# Altium schematic sheet downConverter.SchDoc
size A4
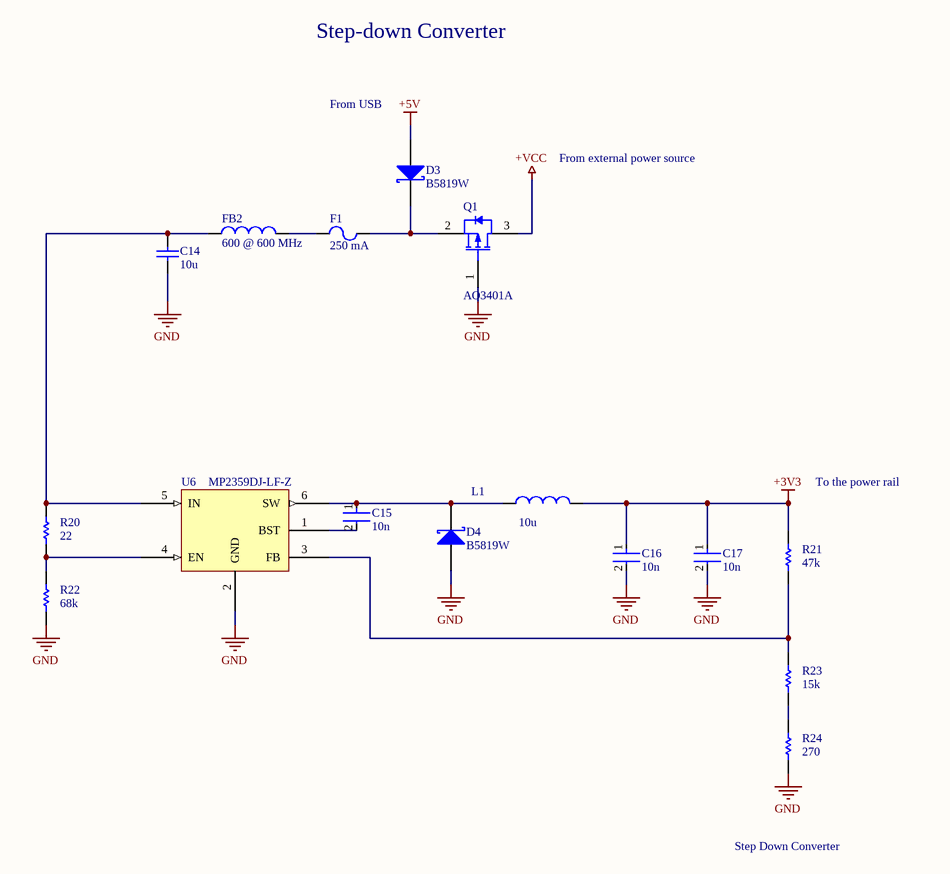
[diagram p0: downConverter.SchDoc]

## Parts
C14  10u  [Capacitor 1206]
C15  10n  [Capacitor 0402]
C16  10n  [Capacitor 0402]
C17  10n  [Capacitor 0402]
D3  B5819W  [SOD3716X135N]
D4  B5819W  [SOD3716X135N]
F1  250 mA  [Fuse 1206]
FB2  600 @ 600 MHz  [Inductor 0805]
L1  10u  [LQH32DN100K23L]
Q1  AO3401A  [SOT95P245X110-3N]
R20  22  [RESISTOR 0603]
R21  47k  [RESISTOR 0603]
R22  68k  [RESISTOR 0603]
R23  15k  [RESISTOR 0603]
R24  270  [RESISTOR 0603]
U6  MP2359DJ-LF-Z  [SOT95P280X100-6N]

## Nets
+3V3: C16.1 C17.1 L1.2 R21.2
+5V: D3.1(A)
+VCC: Q1.3(DRAIN)
GND: C14.1 C16.2 C17.2 D4.1(A) Q1.1(GATE) R22.1 R24.1 U6.2(GND)
NetC14_2: C14.2 FB2.1 R20.2 U6.5(IN)
NetC15_1: C15.1 D4.2(K) L1.1 U6.6(SW)
NetC15_2: C15.2 U6.1(BST)
NetD3_2: D3.2(K) F1.2 Q1.2(SOURCE)
NetF1_1: F1.1 FB2.2
NetR20_1: R20.1 R22.2 U6.4(EN)
NetR21_1: R21.1 R23.2 U6.3(FB)
NetR23_1: R23.1 R24.2

## Notes on the sheet
- Step-down Converter
- From USB
- From external power source
- To the power rail
- Step Down Converter

## Library data of the parts
C14 = Capacitor 1206: Chip Capacitor, 1206; Manufacturer: Murata; Manufacturer Part Number: GRM1885C1H220JA01D; Capacitance: 22pF; Tolerance (%): ±5%; Rated Voltage: 50V; Dielectric: C0G; Manufacturer URL: http://www.murata.com/; Datasheet Version: Jul-06; Package Reference: 603; Case Size/Dimension: 0603; Package Description: 2-Pin Surface Mount Device, Body 1.6 x 0.8 mm; Datasheet URL: https://datasheet.ciiva.com/11786/0900766b807a1cab-11786398.pdf
C15-C17 = Capacitor 0402: Chip Capacitor 0402; Manufacturer Part Number: CC0402KRX7R7BB103; Manufacturer: Yageo; Automotive Grade: NA; Capacitance: 10 nF; Material: Ceramic; Value: 10 nF; Tolerance: 0.1; Temperature Characteristic: X7R; Voltage Rating: 16 V; Temperature Coefficient: 30ppm/°C; Temperature Range Low: -55°C; Temperature Range High: +125°C; Mouser Description: 0402 10 nF 16 V ±10 % Tolerance X7R SMT Multilayer Ceramic Capacitor; Footprint Url: http://www.yageo.com/exep/pages/download/literatures/UPY-C_GEN_24.pdf; Category: Cap; RoHS: TRUE; ComponentLink2Description: Datasheet; Ipc Land Pattern Name: CAPC10050X50; Automotive: No; ComponentLink2URL: http://www.yageo.com/documents/recent/UPY-GP_NP0_16V-to-50V_16.pdf; Device Class L1: Passive Components; Height: 0.55mm; Package: CC0402; Device Class L3: Ceramic Capacitors; Lead Free: Yes; Device Class L2: Capacitors; Digikey Description: CAP CER 10000PF 16V X7R 0402; Octopart: https://octopart.com/cc0402krx7r7bb103-yageo-192895; Temperature: -55°C to +125°C
D3 D4 = Schottky Barrier Rectifier: Schottky Barrier Rectifier, 20 V, 1 A, -65 to 150 degC, 2-Pin DO-214AC (SMA), RoHS, Tape and Reel; Manufacturer: Vishay Intertechnology; Manufacturer Part Number: SS12-E3\61T; Max Surge Current: 40A; Forward Voltage: 500mV; Forward Current: 1A; Peak Reverse Current: 6mA; Package Quantity: 1800; Datasheet URL: http://www.vishay.com/docs/88746/ss12.pdf; Case/Package: SMA; Package Description: 2-Pin Surface Mount Device, Body 4.245 x 2.665 mm; Pins: 2; Mounting Technology: SM; Min Operating Temperature: -65°C; Packaging: TapeandReel; Datasheet Version: Aug-15; Manufacturer URL: http://www.vishay.com/; RoHS Compliant: True; Package Reference: DO-214AC (SMA); Max Operating Temperature: 125°C; Component Type: Diodes
F1 = Fuse 1206: NANO2(R) Slo-Blo(R) Fuse, 0.5 A, 125 V, -55 to 125 degC, 2-Pin SMD, RoHS, Tape and Reel; Manufacturer: Littelfuse; Manufacturer Part Number: 0452.500MRL; Current Rating: 0.5A; Working Voltage-Max: 125V; Manufacturer URL: http://www.littelfuse.com/; Operating Temp Range: -55to+125°C; Package Reference: 0452; Mounting Technology: SurfaceMount; Datasheet Version: 07/2015; Response Characteristic: Slo-Blo; Datasheet URL: http://download.siliconexpert.com/pdfs/2015/7/2/10/39/10/885/ltf_/manual/4322647674859060843226474844920160littelfuse_fuse_452_454_datasheet.pdf.pdf.pdf; Size: 6.10x2.69mm; Package Description: 2-Pin Surface Mount Device, Body 6.1 x 2.69 mm
FB2 = Ferrite Bead: Ferrite Bead Murata BLM21AG601SN1D; Manufacturer: TDK; Manufacturer Part Number: MLZ2012A1R0MT000; Tolerance (%): 20%; DC Resistance: 0.6; Inductance-Nom: 10H; Rated Current-Max: 100mA; Package Reference: IND0805; Case Size/Dimension: 0805; Manufacturer URL: http://www.murata.com/; Package Description: 2-Pin Surface Mount Device, Body 2 x 1.25 mm; Datasheet URL: http://psearch.en.murata.com/inductor/product/LQM21FN100M70%23.pdf; Mounting Technology: SurfaceMount; Datasheet Version: 05/2016
L1 = Fixed Inductor: LQH32CN100K33L 10uh; Manufacturer: TDK; Manufacturer Part Number: MLZ2012A1R0MT000; Tolerance (%): 20%; DC Resistance: 0.6; Inductance-Nom: 10H; Rated Current-Max: 100mA; Package Reference: IND0805; Case Size/Dimension: 0805; Manufacturer URL: http://www.murata.com/; Package Description: 2-Pin Surface Mount Device, Body 2 x 1.25 mm; Datasheet URL: http://psearch.en.murata.com/inductor/product/LQM21FN100M70%23.pdf; Mounting Technology: SurfaceMount; Datasheet Version: 05/2016
Q1 = P-Channel MOSFET: P-Channel MOSFET, 30 V, 4 A, -55 to 150 degC, 3-Pin SOT-23-3L, RoHS, Tape and Reel; Manufacturer: Alpha & Omega Semiconductor; Output Power (Max): NotRequiredW; Power Dissipation: 1.4W; Rad Hardened: No; Drain Efficiency: NotRequired%; Drain-Source On-Volt: 30V; Noise Figure: NotRequireddB; Frequency (Max): NotRequiredMHz; Number of  Elements: 1; Gate-Source Voltage (Max): ?12V; Drain Current (Max): 4A; Channel Mode: Enhancement; Drain-Source On-Res: 0.044ohm; Type: PowerMOSFET; Polarity: P; Package URL: http://www.aosmd.com/res/packaging_information/SOT-23-3L.pdf; Datasheet URL: http://www.aosmd.com/res/data_sheets/AO3401A.pdf; Package Type: SOT-23; Package Description: 3-Pin Small Outline Transistor, Body 2.95 x 1.6 mm, Pitch 0.95 mm; Mounting: SurfaceMount; Manufacturer URL: http://www.aosmd.com/; Continuous Drain Current: 4A; Package Reference: SOT-23-3L; Mounting Technology: SurfaceMount; Operating Temperature Classification: Military; Power Gain: NotRequireddB; Datasheet Version: Rev. 3, 03/2011; Operating Temp Range: -55Cto150C; Pin Count: 3; Manufacturer Part Number: AO3401A
R20-R24 = Resistor 0603: Chip Resistor 0603; Manufacturer: Vishay; Part Number: CRCW0402120RFKED; Manufacturer Part Number: CRCW0402120RFKED
U6 = MP2359DJ-LF-Z: Regulator